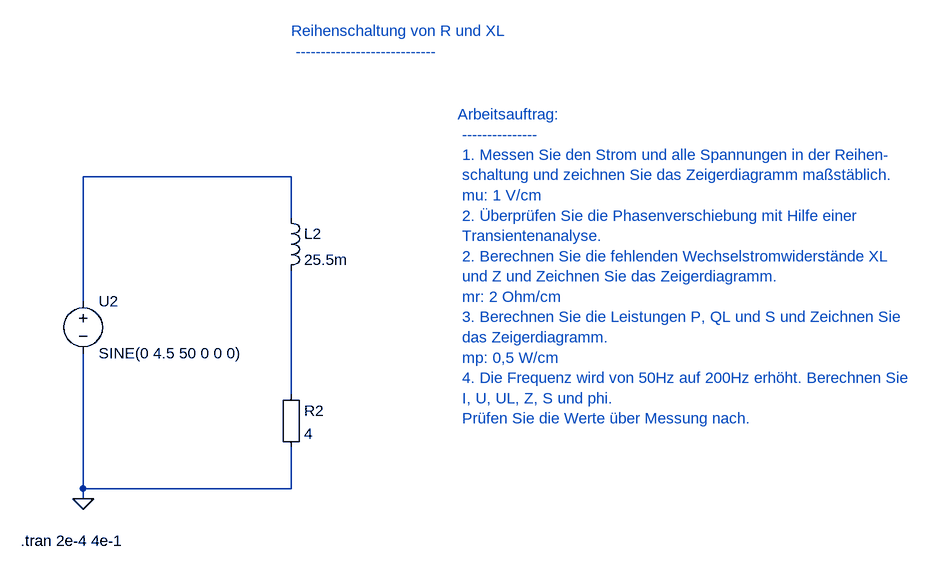
[diagram p0: schematic 13_2_Reihenschaltung von R und XL.asc]
13_2_Reihenschaltung von R und XL.asc, the LTspice schematic file:
Version 4
SHEET 1 880 680
WIRE 160 560 160 576
WIRE 160 576 160 768
WIRE 160 768 160 784
WIRE 480 704 480 768
WIRE 480 768 160 768
WIRE 480 352 480 288
WIRE 480 288 160 288
WIRE 160 288 160 480
WIRE 480 432 480 624
FLAG 160 784 0
SYMBOL voltage 160 464 R0
SYMATTR InstName U2
SYMATTR Value SINE(0 4.5 50 0 0 0)
SYMBOL Misc\EuropeanResistor 464 608 R0
SYMATTR InstName R2
SYMATTR Value 4
SYMBOL ind 464 336 R0
SYMATTR InstName L2
SYMATTR Value 25.5m
TEXT 64 848 Left 2 !.tran 2e-4 4e-1
TEXT 480 64 Left 2 ;Reihenschaltung von R und XL \n ----------------------------
TEXT 736 192 Left 2 ;Arbeitsauftrag: \n --------------- \n 1. Messen Sie den Strom und alle Spannungen in der Reihen- \n schaltung und zeichnen Sie das Zeigerdiagramm maßstäblich. \n mu: 1 V/cm \n 2. Überprüfen Sie die Phasenverschiebung mit Hilfe einer \n Transientenanalyse. \n 2. Berechnen Sie die fehlenden Wechselstromwiderstände XL \n und Z und Zeichnen Sie das Zeigerdiagramm. \n mr: 2 Ohm/cm \n 3. Berechnen Sie die Leistungen P, QL und S und Zeichnen Sie \n das Zeigerdiagramm. \n mp: 0,5 W/cm \n 4. Die Frequenz wird von 50Hz auf 200Hz erhöht. Berechnen Sie \n I, U, UL, Z, S und phi. \n Prüfen Sie die Werte über Messung nach.

The netlist it stands for:
* 13_2_Reihenschaltung von R und XL.asc
V§U2 N001 0 SINE(0 4.5 50 0 0 0)
R2 N002 0 4
L2 N001 N002 25.5m
.tran 2e-4 4e-1
* Reihenschaltung von R und XL
*  ----------------------------
* Arbeitsauftrag:
*  ---------------
*  1. Messen Sie den Strom und alle Spannungen in der Reihen-
*  schaltung und zeichnen Sie das Zeigerdiagramm maßstäblich.
*  mu: 1 V/cm
*  2. Überprüfen Sie die Phasenverschiebung mit Hilfe einer
*  Transientenanalyse.
*  2. Berechnen Sie die fehlenden Wechselstromwiderstände XL
*  und Z und Zeichnen Sie das Zeigerdiagramm.
*  mr: 2 Ohm/cm
*  3. Berechnen Sie die Leistungen P, QL und S und Zeichnen Sie
*  das Zeigerdiagramm.
*  mp: 0,5 W/cm
*  4. Die Frequenz wird von 50Hz auf 200Hz erhöht. Berechnen Sie
*  I, U, UL, Z, S und phi.
*  Prüfen Sie die Werte über Messung nach.
.backanno
.end